# EAGLE schematic LPS22HB_pcb (EAGLE 8.2.2)
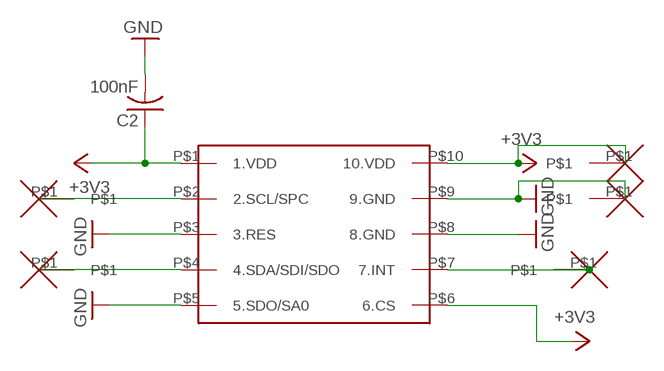
[diagram p0: schematic, sheet 1]

## Parts
C2  100nF  C-USC0402  [C0402]
U$1  LPS22HB_HLGA  [LPS22HB_HLGA]
U$2  WIREPAD_0,8/0,45  [WIREPAD_0,8/0,45]
U$3  WIREPAD_0,8/0,45  [WIREPAD_0,8/0,45]
U$6  WIREPAD_0,8/0,45  [WIREPAD_0,8/0,45]
U$7  WIREPAD_0,8/0,45  [WIREPAD_0,8/0,45]
U$8  WIREPAD_0,8/0,45  [WIREPAD_0,8/0,45]

## Nets
+3V3: C2.1 U$1.P$1(1.VDD) U$1.P$6(6.CS) U$1.P$10(10.VDD) U$8.P$1
GND: C2.2 U$1.P$3(3.RES) U$1.P$5(5.SDO/SA0) U$1.P$8(8.GND) U$1.P$9(9.GND) U$7.P$1
N$4: U$1.P$4(4.SDA/SDI/SDO) U$3.P$1
N$5: U$1.P$2(2.SCL/SPC) U$2.P$1
N$6: U$1.P$7(7.INT) U$6.P$1

## Library data of the parts
C2 = resistor:C-US: CAPACITOR, American symbol
U$1 = LPS22HB:LPS22HB_HLGA
U$2 U$3 U$6-U$8 = wirepad_08-045:WIREPAD_0,8/0,45